# Altium schematic sheet 3-HumiditySensor.SchDoc
size A4; Author: Fabian Castaño; CompanyName: UdeA; Engineer: Fabian Castaño; Organization: Universidad de Antioquia; Address1: UdeA; Address2: Medellín; Address3: Antioquia; Address4: Colombia 050010; DocumentNumber: 4; Revision: Jaime Osorio; SheetNumber: 4; SheetTotal: 12
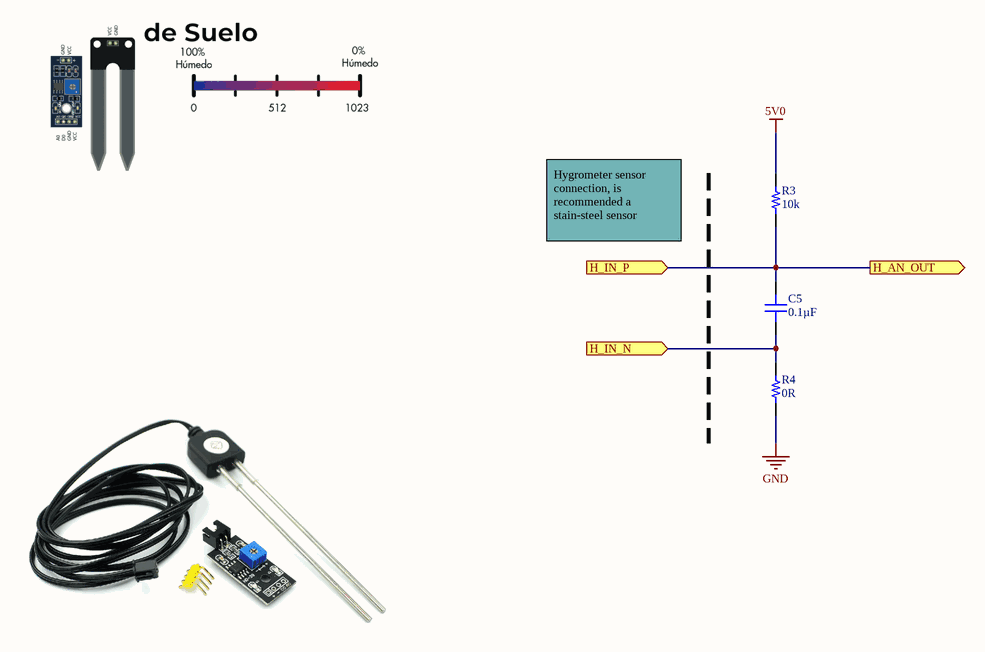
[diagram p0: 3-HumiditySensor.SchDoc]

## Parts
C5  0.1µF  [CAP 0805_2012]
R3  10k  [RES 0805_2012]
R4  0R  [RES 0805_2012]

## Ports
H_AN_OUT (out), H_IN_N (in), H_IN_P (in)

## Nets
5V0: R3.2
GND: R4.1
H_AN_OUT: C5.2 R3.1 ; port H_IN_P, port H_AN_OUT
H_IN_N: C5.1 R4.2 ; port H_IN_N

## Notes on the sheet
- Hygrometer sensor connection, is recommended a stain-steel sensor
- Title
- Size:
- Date:
- A4
- Enginner:
- Time:
- Revision:
- Sheet
- of
- Author:
- File:

## Library data of the parts
C5 = C0805C104M5RACAUTO: CAP CER 0.1UF 50V X7R 0805; Manufacturer: KEMET; Tolerance: ±20%; Part Number: C0805C104M5RACAUTO; Value: 0.1µF; Applications: Automotive, Bypass, Decoupling; Capacitance: 0.1µF; ComponentLink1Description: Datasheet; ComponentLink1URL: https://api.kemet.com/component-edge/download/datasheet/C0805C104M5RACAUTO.pdf; ComponentLink2Description: DigiKey Link; ComponentLink2URL: http://digikey.com/product-detail/en/kemet/C0805C104M5RACAUTO/399-12977-1-ND/5762259; Device Package: 0805 (2012 Metric); LastUpdated: 2/09/2020 01:04:42; Lifecycle Status: Active; Minimum Order: 1; Mounting Type: Surface Mount, MLCC; Operating Temperature: -55°C ~ 125°C; Package / Case: 0805 (2012 Metric); Packaging: TapeAndReel; PartId: 2568; Part Status: Active; Price: 0.02; Ratings: AEC-Q200; Series: SMD Auto X7R; Size / Dimension: 0.079" L x 0.049" W (2.00mm x 1.25mm); Supplier 1: DigiKey; Supplier Part Number 1: 399-12977-1-ND; Temperature Coefficient: X7R; Thickness (Max): 0.035" (0.88mm); Voltage - Rated: 50V
R3 R4 = RC0805FR-071K47L: RES SMD 1.47K OHM 1% 1/8W 0805; Manufacturer: Yageo; Power (Watts): 0.125W, 1/8W; Resistance: 1.47 kOhms; Temperature Coefficient: ±100ppm/°C; Part Number: RC0805FR-071K47L; ComponentLink1Description: Datasheet; ComponentLink1URL: https://www.yageo.com/upload/media/product/productsearch/datasheet/rchip/PYu-RC_Group_51_RoHS_L_10.pdf; ComponentLink2Description: DigiKey Link; ComponentLink2URL: http://digikey.com/product-detail/en/yageo/RC0805FR-071K47L/311-1.47KCRCT-ND/730440; Composition: Thick Film; Device Package: 0805 (2012 Metric); Features: Moisture Resistant; Height - Seated (Max): 0.024" (0.60mm); LastUpdated: 2/09/2020 01:14:46; Lifecycle Status: Active; Minimum Order: 1; Number of Terminations: 2; Operating Temperature: -55°C ~ 155°C; Package / Case: 0805 (2012 Metric); Packaging: CutTape; PartId: 44768; Part Status: Active; Price: 0.10; Series: RC; Size / Dimension: 0.079" L x 0.049" W (2.00mm x 1.25mm); Supplier 1: DigiKey; Supplier Part Number 1: 311-1.47KCRCT-ND; Supplier Device Package: 0805; Tolerance: ±1%
  R3: Value: 10k
  R4: Value: 0R